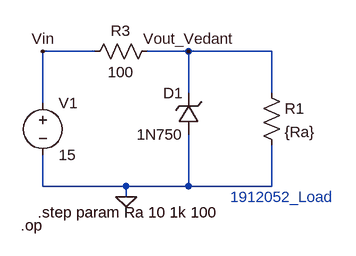
[diagram p0: schematic Draft23.asc]
Draft23.asc, the LTspice schematic file:
Version 4
SHEET 1 880 680
WIRE 80 64 0 64
WIRE 224 64 160 64
WIRE 352 64 224 64
WIRE 224 128 224 64
WIRE 352 128 352 64
WIRE 0 144 0 64
WIRE 0 272 0 224
WIRE 128 272 0 272
WIRE 224 272 224 192
WIRE 224 272 128 272
WIRE 352 272 352 208
WIRE 352 272 224 272
WIRE 128 288 128 272
FLAG 128 288 0
FLAG 224 64 Vout_Vedant
FLAG 0 64 Vin
SYMBOL voltage 0 128 R0
WINDOW 123 0 0 Left 0
WINDOW 39 0 0 Left 0
SYMATTR InstName V1
SYMATTR Value 15
SYMBOL res 336 112 R0
SYMATTR InstName R1
SYMATTR Value {Ra}
SYMBOL res 176 48 R90
WINDOW 0 0 56 VBottom 2
WINDOW 3 32 56 VTop 2
SYMATTR InstName R3
SYMATTR Value 100
SYMBOL zener 240 192 R180
WINDOW 0 24 64 Left 2
WINDOW 3 24 0 Left 2
SYMATTR InstName D1
SYMATTR Value 1N750
SYMATTR Description Diode
SYMATTR Type diode
TEXT -8 312 Left 2 !.step param Ra 10 1k 100
TEXT -34 332 Left 2 !.op
TEXT 288 288 Left 2 ;1912052_Load

The netlist it stands for:
* Draft23.asc
V1 Vin 0 15
R1 Vout_Vedant 0 {Ra}
R3 Vout_Vedant Vin 100
D1 0 Vout_Vedant 1N750
.model D D
.lib standard.dio
.step param Ra 10 1k 100
.op
* 1912052_Load
.backanno
.end